# EAGLE schematic ESP32-Cam-Pico-V4 (EAGLE 9.6.2)
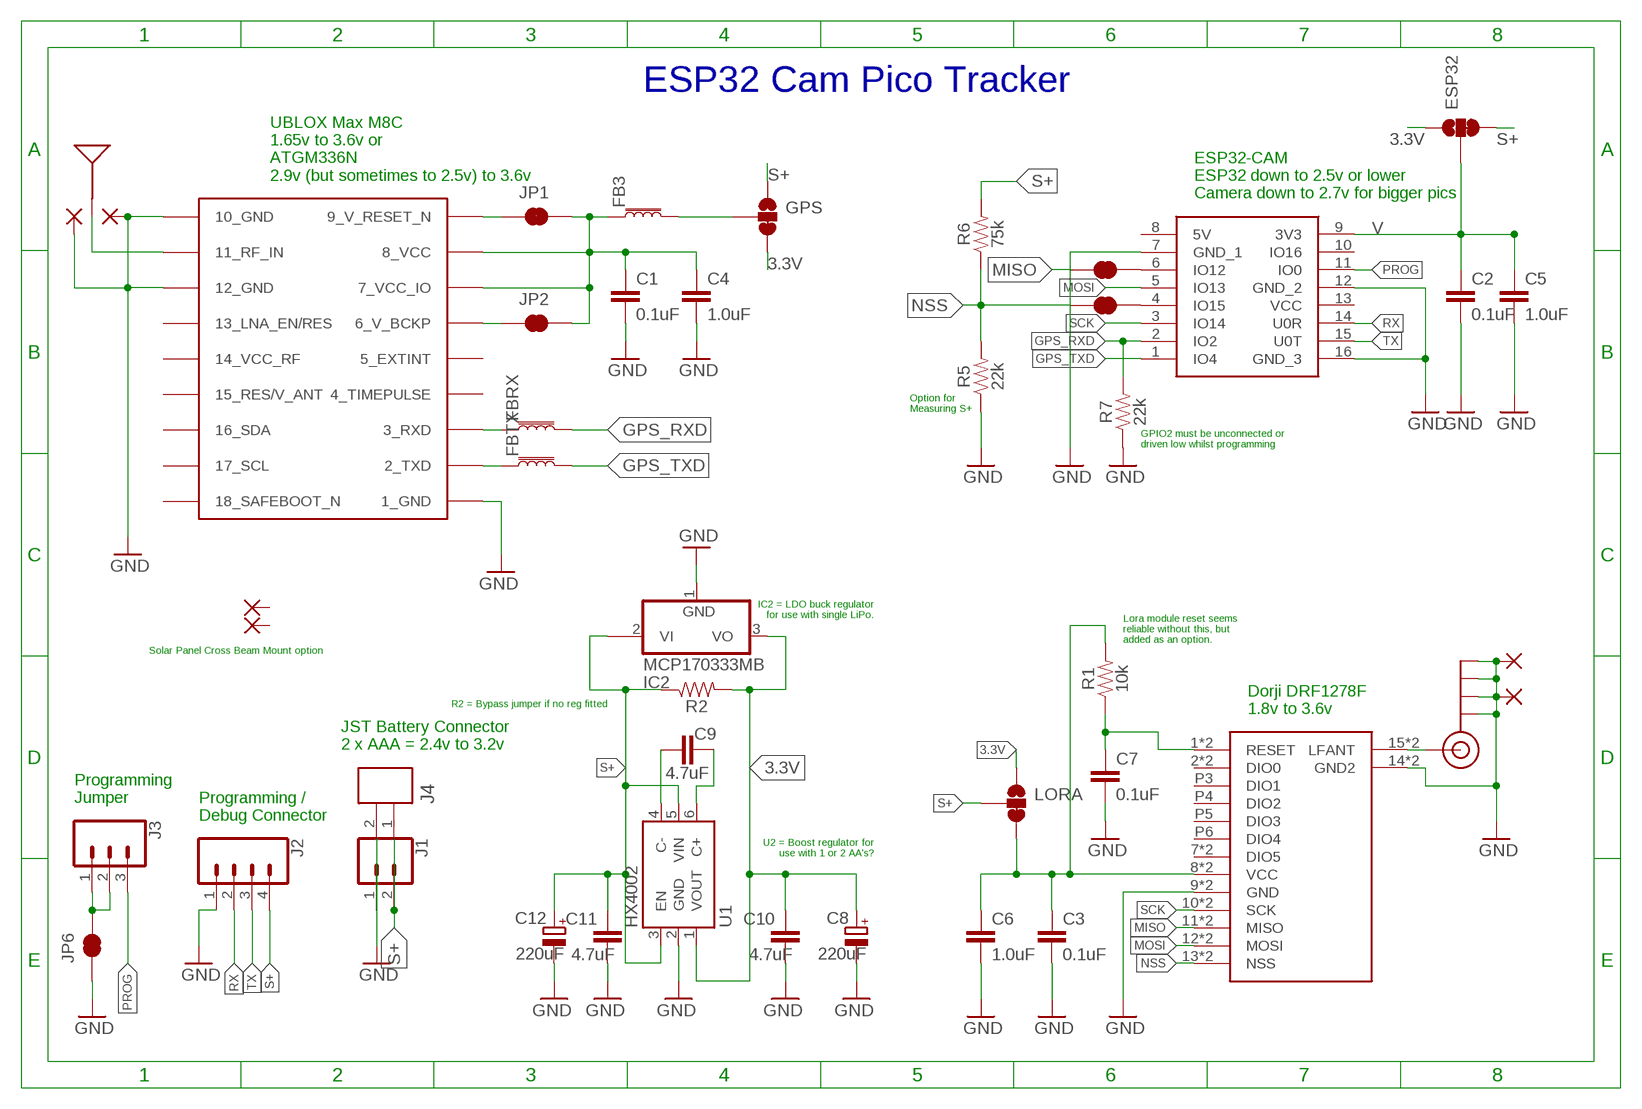
[diagram p0: schematic, sheet 1]

## Parts
C1  0.1uF  0.1UF-0402-6.3V-10%-X7R  [0402]
C2  0.1uF  0.1UF-0402-6.3V-10%-X7R  [0402]
C3  0.1uF  0.1UF-0402-6.3V-10%-X7R  [0402]
C4  1.0uF  1.0UF-0402-16V-10%  [0402]
C5  1.0uF  1.0UF-0402-16V-10%  [0402]
C6  1.0uF  1.0UF-0402-16V-10%  [0402]
C7  0.1uF  0.1UF-0402-6.3V-10%-X7R  [0402]
C8  220uF  CPOL-EUSMCC  [SMC_C]
C9  4.7uF  1.0UF-0402-16V-10%  [0402]
C10  4.7uF  1.0UF-0402-16V-10%  [0402]
C11  4.7uF  1.0UF-0402-16V-10%  [0402]
C12  220uF  CPOL-EUSMCC  [SMC_C]
ESP32  JUMPER-SMT_3_1-NC_TRACE_SILK  [SMT-JUMPER_3_1-NC_TRACE_SILK]
FB3  FERRITE_BEAD-120_OHM-0402  [0402]
FBRX  FERRITE_BEAD-120_OHM-0402  [0402]
FBTX  FERRITE_BEAD-120_OHM-0402  [0402]
GPS  JUMPER-SMT_3_1-NC_TRACE_SILK  [SMT-JUMPER_3_1-NC_TRACE_SILK]
IC1  ESP32-CAM  [ESP32CAM]
IC2  MCP170333MB  [SOT89]
J1  CONN_02JST-PTH-2-KIT  [JST-2-PTH-KIT]
J2  CONN_04LOCK  [1X04_LOCK]
J3  CONN_03LOCK  [1X03_LOCK]
J4  JST_ZH_2PIN  [JST_ZH_2PIN]
J$1  SMA_EDGE  [SMA-EDGE]
JP1  JUMPER-SMT_2_NC_TRACE_NO-SILK  [SMT-JUMPER_2_NC_TRACE_NO-SILK]
JP2  JUMPER-SMT_2_NC_TRACE_NO-SILK  [SMT-JUMPER_2_NC_TRACE_NO-SILK]
JP6  JUMPER-SMT_2_NC_TRACE_NO-SILK  [SMT-JUMPER_2_NC_TRACE_NO-SILK]
JP9  JUMPER-SMT_2_NC_TRACE_NO-SILK  [SMT-JUMPER_2_NC_TRACE_NO-SILK]
JP10  JUMPER-SMT_2_NC_TRACE_NO-SILK  [SMT-JUMPER_2_NC_TRACE_NO-SILK]
LORA  JUMPER-SMT_3_1-NC_TRACE_SILK  [SMT-JUMPER_3_1-NC_TRACE_SILK]
PAD1  1,6/0,8  [1,6/0,8]
PAD2  1,6/0,8  [1,6/0,8]
PAD3  1,6/0,8  [1,6/0,8]
PAD4  1,6/0,8  [1,6/0,8]
PAD5  SMD2  [SMD1,27-2,54]
PAD6  SMD2  [SMD1,27-2,54]
R1  10k  10KOHM-0402-1/16W-1%  [0402]
R2  0k  10KOHM-0402-1/16W-1%  [0402]
R5  22k  10KOHM-0402-1/16W-1%  [0402]
R6  75k  10KOHM-0402-1/16W-1%  [0402]
R7  22k  10KOHM-0402-1/16W-1%  [0402]
U1  HX4002  CE021SOT-23  [SOT23-6]
U$1  MAX-M8  [MAX-M8]
U$2  1.575GHz  ANTENNAGPS-2X7MM  [ANT-GPS-2X7MM]
U$3  DRF1278F_2LESS_PINS  [DRF1278F_2_LESS_PINS]

## Nets
3.3V: C8.+ C10.1 ESP32.1 GPS.3 IC2.3(VO) LORA.1 R2.2 U1.1(VOUT)
ANT: J$1.SIG(SIGNAL) U$3.15(LFANT) U$3.P15(LFANT)
GND: C1.2 C2.2 C3.2 C4.2 C5.2 C6.2 C7.2 C8.- C10.2 C11.2 C12.- IC1.7(GND_1) IC1.12(GND_2) IC1.16(GND_3) IC2.1(GND) J1.1 J2.1 J4.2 J$1.GND@0(GND) J$1.GND@1(GND) J$1.GND@2(GND) J$1.GND@3(GND) JP6.1 PAD1.1(P) PAD2.1(P) PAD3.1(P) PAD4.1(P) R5.1 R7.1 U1.2(GND) U$1.1_GND U$1.10_GND U$1.12_GND U$3.9(GND) U$3.14(GND2) U$3.P9(GND) U$3.P14(GND2)
GPS_RXD: FBRX.2 IC1.2(IO2) R7.2
GPS_TXD: FBTX.2 IC1.1(IO4)
MISO: JP9.1 U$3.11(MISO) U$3.P11(MISO)
MOSI: IC1.5(IO13) U$3.12(MOSI) U$3.P12(MOSI)
N$1: U$1.11_RF_IN U$2.1(SIGNAL)
N$2: FBRX.1 U$1.3_RXD
N$3: FBTX.1 U$1.2_TXD
N$5: JP1.1 U$1.9_RESET_N(9_V_RESET_N)
N$6: JP2.1 U$1.6_V_BCKP
N$8: C7.1 R1.1 U$3.1(RESET) U$3.P1(RESET)
N$9: FB3.2 GPS.2
N$11: C1.1 C4.1 FB3.1 JP1.2 JP2.2 U$1.7_VCC_IO U$1.8_VCC
N$12: C9.2 U1.4(C-)
N$15: J3.1 J3.2 JP6.2
N$17: C9.1 U1.6(C+)
N$18: IC1.6(IO12) JP9.2
N$20: IC1.4(IO15) JP10.2
NSS: JP10.1 R5.2 R6.1 U$3.13(NSS) U$3.P13(NSS)
PROG: IC1.11(IO0) J3.3
RX: IC1.14(U0R) J2.2
S+: C3.1 C6.1 C11.1 C12.+ ESP32.3 GPS.1 IC2.2@1(VI1) J1.2 J2.4 J4.1 LORA.2 LORA.3 R1.2 R2.1 R6.2 U1.3(EN) U1.5(VIN) U$3.8(VCC) U$3.P8(VCC)
SCK: IC1.3(IO14) U$3.10(SCK) U$3.P10(SCK)
TX: IC1.15(U0T) J2.3
V: C2.1 C5.1 ESP32.2 IC1.9(3V3)
Unconnected: IC1.8(5V) IC1.10(IO16) IC1.13(VCC) IC2.2(VI) PAD5.1(P) PAD6.1(P) U$1.4_TIMEPULSE U$1.5_EXTINT U$1.13_LNA_EN(13_LNA_EN/RES) U$1.14_VCC_RF U$1.15_V_ANT/RESERVED(15_RES/V_ANT) U$1.16_SDA U$1.17_SCL U$1.18_SAFEBOOT_N U$3.2(DIO0) U$3.7(DIO5) U$3.P2(DIO0) U$3.P3(DIO1) U$3.P4(DIO2) U$3.P5(DIO3) U$3.P6(DIO4) U$3.P7(DIO5)

## Notes on the sheet
- ESP32 Cam Pico Tracker
- UBLOX Max M8C
  1.65v to 3.6v or
  ATGM336N
  2.9v (but sometimes to 2.5v) to 3.6v
- ESP32-CAM
  ESP32 down to 2.5v or lower
  Camera down to 2.7v for bigger pics
- Option for 
  Measuring S+
- GPIO2 must be unconnected or
  driven low whilst programming
- IC2 = LDO buck regulator
  for use with single LiPo.
- Lora module reset seems 
  reliable without this, but 
  added as an option.
- Solar Panel Cross Beam Mount option
- R2 = Bypass jumper if no reg fitted
- Dorji DRF1278F
  1.8v to 3.6v
- JST Battery Connector
  2 x AAA = 2.4v to 3.2v
- Programming
  Jumper
- Programming / 
  Debug Connector
- U2 = Boost regulator for
  use with 1 or 2 AA's?

## Library data of the parts
C1-C3 C7 = SparkFun-Capacitors:0.1UF: 0.1µF ceramic capacitors A capacitor is a passive two-terminal electrical component used to store electrical energy temporarily in an electric field.; PROD_ID: CAP-14993
C4-C6 = SparkFun-Capacitors:1.0UF: 1µF ceramic capacitors A capacitor is a passive two-terminal electrical component used to store electrical energy temporarily in an electric field.; PROD_ID: CAP-12417
C8 C12 = rcl:CPOL-EU: POLARIZED CAPACITOR, European symbol; SPICEPREFIX: C
C9-C11 = SparkFun-Capacitors:1.0UF: 1µF ceramic capacitors A capacitor is a passive two-terminal electrical component used to store electrical energy temporarily in an electric field.; PROD_ID: CAP-12417; VALUE: 1.0uF
ESP32 GPS LORA = SparkFun-Jumpers:JUMPER-SMT_3_1-NC_TRACE: Normally closed trace jumper (1 of 2 connections) This jumper has a trace between two pads so it's normally closed (NC). The other connection is normally open (NO). Use a razor knife to open the connection. For best results follow the IPC guidelines for cutting traces: Cutout at least 0.063 mm (0.005 in). Remove all loose material to clean up the cut area. Seal the cut with an approved epoxy. Reapply solder to reclose the connection, or to close the NO connection.
FB3 FBRX FBTX = SparkFun-Coils:FERRITE_BEAD-120_OHM: Ferrite Bead (blocks, cores, rings, chokes, etc.) Inductor with layers of ferrite used to suppress high frequencies. Often used to isolate high frequency noise.; MFG_PART: BLM15HB121SN1D; PROD_ID: NDUC-14206
IC1 = ESP32-CAM:ESP32-CAM: Modules PCBA Module RoHS Source: Datasheet <https://datasheet.lcsc.com/szlcsc/Ai-Thinker-ESP32-CAM_C277946.pdf>; DESCRIPTION: Modules PCBA Module RoHS; HEIGHT: 5mm; MANUFACTURER_NAME: Ai-Thinker; MANUFACTURER_PART_NUMBER: ESP32-CAM
IC2 = linear:MCP1703*: 250 mA, 16V, Low Quiescent Current LDO Regulator Source: http://ww1.microchip.com/downloads/en/DeviceDoc/22049b.pdf
J1 = SparkFun-Connectors:CONN_02: Multi connection point. Often used as Generic Header-pin footprint for 0.1 inch spaced/style header connections On any of the 0.1 inch spaced packages, you can populate with these: Break Away Headers - Straight <https://www.sparkfun.com/products/116> (PRT-00116) Break Away Male Headers - Right Angle <https://www.sparkfun.com/products/553> (PRT-00553) Female Headers <https://www.sparkfun.com/products/115> (PRT-00115) Break Away Headers - Machine Pin <https://www.sparkfun.com/products/117> (PRT-00117) Break Away Female Headers - Swiss Machine Pin <https://www.sparkfun.com/products/743> (PRT-00743) For SCREWTERMINALS and SPRING TERMINALS visit here: Screw Terimnals on SparkFun.com <https://www.sparkfun.com/search/results?term=Screw+Terminals> (5mm/3.5mm/2.54mm spacing) This device is also useful as a general connection point to wire up your design to another part of your project. Our various solder wires solder well into these plated through hole pads. Hook-Up Wire - Assortment (Stranded, 22 AWG) <https://www.sparkfun.com/products/11375> (PRT-11375) Hook-Up Wire - Assortment (Solid Core, 22 AWG) <https://www.sparkfun.com/products/11367> (PRT-11367) View the entire wire category on our website here <https://www.sparkfun.com/categories/141> Special notes: Molex polarized connector foot print use with: PRT-08233 with associated crimp pins and housings. 2.54_SCREWTERM for use with PRT-10571. 3.5mm Screw Terminal footprints for PRT-08084 5mm Screw Terminal footprints for use with PRT-08432
J2 = SparkFun-Connectors:CONN_04: Multi connection point. Often used as Generic Header-pin footprint for 0.1 inch spaced/style header connections On any of the 0.1 inch spaced packages, you can populate with these: Break Away Headers - Straight <https://www.sparkfun.com/products/116> (PRT-00116) Break Away Male Headers - Right Angle <https://www.sparkfun.com/products/553> (PRT-00553) Female Headers <https://www.sparkfun.com/products/115> (PRT-00115) Break Away Headers - Machine Pin <https://www.sparkfun.com/products/117> (PRT-00117) Break Away Female Headers - Swiss Machine Pin <https://www.sparkfun.com/products/743> (PRT-00743) For SCREWTERMINALS and SPRING TERMINALS visit here: Screw Terimnals on SparkFun.com <https://www.sparkfun.com/search/results?term=Screw+Terminals> (5mm/3.5mm/2.54mm spacing) This device is also useful as a general connection point to wire up your design to another part of your project. Our various solder wires solder well into these plated through hole pads. Hook-Up Wire - Assortment (Stranded, 22 AWG) <https://www.sparkfun.com/products/11375> (PRT-11375) Hook-Up Wire - Assortment (Solid Core, 22 AWG) <https://www.sparkfun.com/products/11367> (PRT-11367) View the entire wire category on our website here <https://www.sparkfun.com/categories/141> Special notes: Molex polarized connector foot print use with SKU : PRT-08231 with associated crimp pins and housings. 1MM SMD Version SKU: PRT-10208; PROD_ID: CONN-09696
J3 = SparkFun-Connectors:CONN_03: Multi connection point. Often used as Generic Header-pin footprint for 0.1 inch spaced/style header connections On any of the 0.1 inch spaced packages, you can populate with these: Break Away Headers - Straight <https://www.sparkfun.com/products/116> (PRT-00116) Break Away Male Headers - Right Angle <https://www.sparkfun.com/products/553> (PRT-00553) Female Headers <https://www.sparkfun.com/products/115> (PRT-00115) Break Away Headers - Machine Pin <https://www.sparkfun.com/products/117> (PRT-00117) Break Away Female Headers - Swiss Machine Pin <https://www.sparkfun.com/products/743> (PRT-00743) Stackable Header - 3 Pin (Female, 0.1") <https://www.sparkfun.com/products/13875> (PRT-13875) For SCREWTERMINALS and SPRING TERMINALS visit here: Screw Terimnals on SparkFun.com <https://www.sparkfun.com/search/results?term=Screw+Terminals> (5mm/3.5mm/2.54mm spacing) This device is also useful as a general connection point to wire up your design to another part of your project. Our various solder wires solder well into these plated through hole pads. Hook-Up Wire - Assortment (Stranded, 22 AWG) <https://www.sparkfun.com/products/11375> (PRT-11375) Hook-Up Wire - Assortment (Solid Core, 22 AWG) <https://www.sparkfun.com/products/11367> (PRT-11367) View the entire wire category on our website here <https://www.sparkfun.com/categories/141> Special notes: Molex polarized connector foot print use with SKU : PRT-08232 with associated crimp pins and housings.
J4 = kanflo:JST_ZH_2PIN: JST ZH connector, 2 pins ZH has 1.5mm spacing. Datasheet <http://www.jst-mfg.com/product/pdf/eng/eZH.pdf>
J$1 = SparkFun-Retired:SMA_EDGE: SMA Antenna Connector End launch SMA connector. The paste layer has been removed so that the connector can be hand soldered onto the board after reflow.
JP1 JP2 JP6 JP9 JP10 = SparkFun-Jumpers:JUMPER-SMT_2_NC_TRACE: Normally closed trace jumper This jumper has a trace between two pads so it's normally closed (NC). Use a razor knife to open the connection. For best results follow the IPC guidelines for cutting traces: Cutout at least 0.063 mm (0.005 in). Remove all loose material to clean up the cut area. Seal the cut with an approved epoxy. Reapply solder to reclose the connection.
PAD1-PAD4 = wirepad:1,6/0,8: THROUGH-HOLE PAD
PAD5 PAD6 = wirepad:SMD2: SMD PAD
R1 = SparkFun-Resistors:10KOHM: 10kΩ resistor A resistor is a passive two-terminal electrical component that implements electrical resistance as a circuit element. Resistors act to reduce current flow, and, at the same time, act to lower voltage levels within circuits. - Wikipedia; PROD_ID: RES-14241
R2 R5-R7 = SparkFun-Resistors:10KOHM: 10kΩ resistor A resistor is a passive two-terminal electrical component that implements electrical resistance as a circuit element. Resistors act to reduce current flow, and, at the same time, act to lower voltage levels within circuits. - Wikipedia; PROD_ID: RES-14241; VALUE: 10k
U1 = KEW_HF_V13a:CE021: CE021 Hexin 3.3v Boost/Buck, SOT23-6 Datasheet <http://www.jiecx.com/files856985665897965/productpdf/2013-7-5/545010255.pdf>
U$1 = ubloxLib:MAX-M8: u-blox MAX GNSS module
U$2 = SparkFun-GPS:ANTENNA: Single-ended Antennae 1.575GHz antennae with just one terminal. These are all chip antennae. 1575MHz (GPS) Antennae ANT-GPS-2X7MM - 2.0 x 7.0 mm chip antenna. (SparkFun Product <https://www.sparkfun.com/products/9131>) ANT-GPS-2X8MM - 2.0 x 8.0 mm chip antenna. (SparkFun Product <https://www.sparkfun.com/products/8418>); PROD_ID: ANT-09087; SF_ID: GPS-09131
U$3 = DRF1278F:DRF1278F_2